# EAGLE schematic PC (EAGLE 9.6.2)
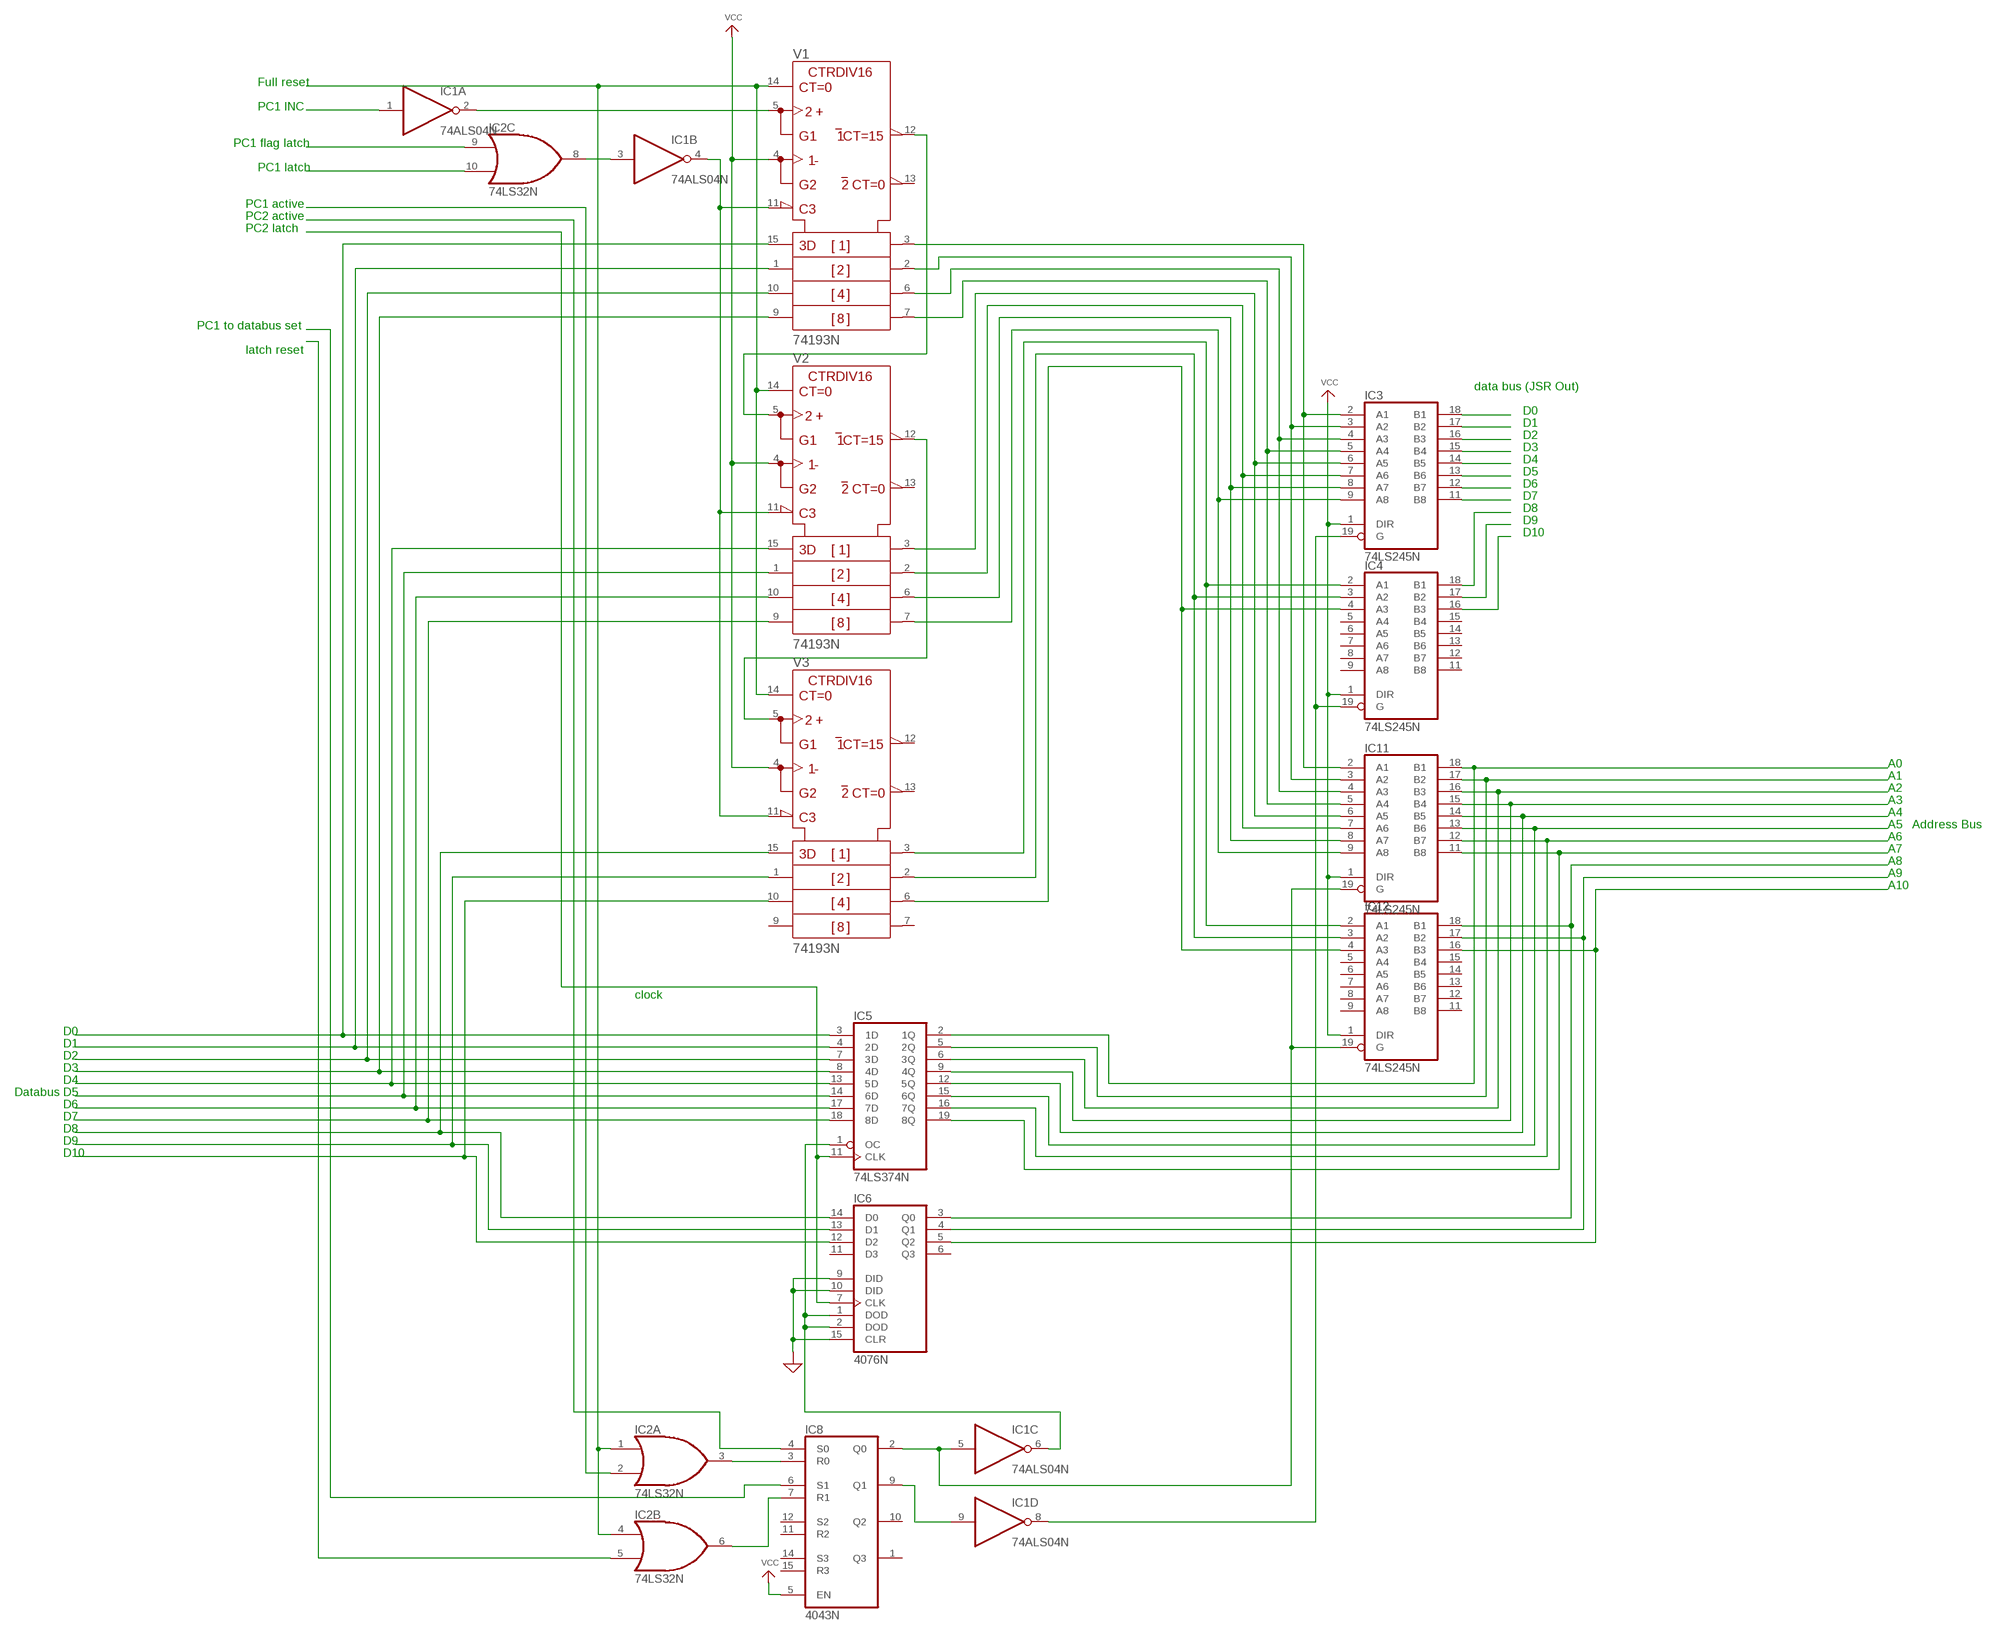
[diagram p0: schematic, sheet 1]

## Parts
IC1  74ALS04N  [DIL14]
IC2  74LS32N  [DIL14]
IC3  74LS245N  [DIL20]
IC4  74LS245N  [DIL20]
IC5  74LS374N  [DIL20]
IC6  4076N  [DIL16]
IC8  4043N  [DIL16]
IC11  74LS245N  [DIL20]
IC12  74LS245N  [DIL20]
V1  74193N  [DIL16]
V2  74193N  [DIL16]
V3  74193N  [DIL16]

## Nets
GND: IC6.9(DID) IC6.10(DID) IC6.15(CLR) ; supply symbol labelled SUP
N$1: V1.12(!CO) V2.5(UP)
N$2: IC8.6(S1)
N$3: V2.12(!CO) V3.5(UP)
N$4: IC1.2(A:O) V1.5(UP)
N$5: IC1.4(B:O) V1.11(!LOAD) V2.11(!LOAD) V3.11(!LOAD)
N$6: IC1.3(B:I) IC2.8(C:O)
N$7: IC2.9(C:I0)
N$8: IC2.10(C:I1)
N$9: IC2.3(A:O) IC8.3(R0)
N$10: IC5.11(CLK) IC6.7(CLK)
N$11: IC2.2(A:I1)
N$12: IC1.5(C:I) IC8.2(Q0) IC11.19(G) IC12.19(G)
N$13: IC6.3(Q0) IC12.18(B1)
N$14: IC8.4(S0)
N$15: IC5.3(1D) V1.15(A)
N$16: IC3.2(A1) IC11.2(A1) V1.3(QA)
N$17: IC5.7(3D) V1.10(C)
N$18: IC5.8(4D) V1.9(D)
N$19: IC5.13(5D) V2.15(A)
N$20: IC5.14(6D) V2.1(B)
N$21: IC5.17(7D) V2.10(C)
N$22: IC3.3(A2) IC11.3(A2) V1.2(QB)
N$23: IC6.14(D0) V3.15(A)
N$24: IC6.13(D1) V3.1(B)
N$25: IC6.12(D2) V3.10(C)
N$26: IC1.1(A:I)
N$27: IC5.4(2D) V1.1(B)
N$28: IC3.5(A4) IC11.5(A4) V1.7(QD)
N$29: IC3.6(A5) IC11.6(A5) V2.3(QA)
N$30: IC3.7(A6) IC11.7(A6) V2.2(QB)
N$31: IC5.18(8D) V2.9(D)
N$32: IC3.8(A7) IC11.8(A7) V2.6(QC)
N$34: IC4.2(A1) IC12.2(A1) V3.3(QA)
N$35: IC4.3(A2) IC12.3(A2) V3.2(QB)
N$36: IC4.4(A3) IC12.4(A3) V3.6(QC)
N$37: IC2.1(A:I0) IC2.4(B:I0) V1.14(CLR) V2.14(CLR) V3.14(CLR)
N$38: IC2.5(B:I1)
N$39: IC1.9(D:I) IC8.9(Q1)
N$40: IC2.6(B:O) IC8.7(R1)
N$41: IC1.8(D:O) IC3.19(G) IC4.19(G)
N$42: IC1.6(C:O) IC5.1(OC) IC6.1(DOD) IC6.2(DOD)
N$44: IC3.4(A3) IC11.4(A3) V1.6(QC)
N$47: IC5.2(1Q) IC11.18(B1)
N$50: IC3.18(B1)
N$51: IC3.17(B2)
N$52: IC3.16(B3)
N$53: IC3.15(B4)
N$54: IC3.14(B5)
N$55: IC3.13(B6)
N$56: IC3.12(B7)
N$57: IC3.11(B8)
N$58: IC4.18(B1)
N$59: IC4.17(B2)
N$60: IC4.16(B3)
N$62: IC5.5(2Q) IC11.17(B2)
N$63: IC5.6(3Q) IC11.16(B3)
N$64: IC5.9(4Q) IC11.15(B4)
N$65: IC5.12(5Q) IC11.14(B5)
N$68: IC5.15(6Q) IC11.13(B6)
N$69: IC5.16(7Q) IC11.12(B7)
N$70: IC5.19(8Q) IC11.11(B8)
N$71: IC3.9(A8) IC11.9(A8) V2.7(QD)
N$72: IC6.4(Q1) IC12.17(B2)
N$73: IC6.5(Q2) IC12.16(B3)
VCC: IC3.1(DIR) IC4.1(DIR) IC8.5(EN) IC11.1(DIR) IC12.1(DIR) V1.4(DOWN) V2.4(DOWN) V3.4(DOWN)
Unconnected: IC1.10(E:O) IC1.11(E:I) IC1.12(F:O) IC1.13(F:I) IC2.11(D:O) IC2.12(D:I0) IC2.13(D:I1) IC4.5(A4) IC4.6(A5) IC4.7(A6) IC4.8(A7) IC4.9(A8) IC4.11(B8) IC4.12(B7) IC4.13(B6) IC4.14(B5) IC4.15(B4) IC6.6(Q3) IC6.11(D3) IC8.1(Q3) IC8.10(Q2) IC8.11(R2) IC8.12(S2) IC8.14(S3) IC8.15(R3) IC12.5(A4) IC12.6(A5) IC12.7(A6) IC12.8(A7) IC12.9(A8) IC12.11(B8) IC12.12(B7) IC12.13(B6) IC12.14(B5) IC12.15(B4) V1.13(!BO) V2.13(!BO) V3.7(QD) V3.9(D) V3.12(!CO) V3.13(!BO)

## Notes on the sheet
- Full reset
- PC1 INC
- PC1 flag latch
- PC1 latch
- PC1 active
- PC2 active
- PC2 latch
- PC1 to databus set
- latch reset
- data bus (JSR Out)
- D0
- D1
- D2
- D3
- D4
- D5
- D6
- D7
- D8
- D9
- D10
- A0
- A1
- A2
- A3
- A4
- A5 | Address Bus
- A6
- A7
- A8
- A9
- A10
- clock
- D0
- D1
- D2
- D3
- D4
- Databus | D5
- D6
- D7
- D8
- D9
- D10

## Power pins joined to a net without a drawn wire
+UB: V1.16(+UB) V2.16(+UB) V3.16(+UB)
-UB: V1.8(-UB) V2.8(-UB) V3.8(-UB)
GND: IC1.7(P:GND) IC2.7(P:GND) IC3.10(GND) IC4.10(GND) IC5.10(GND) IC11.10(GND) IC12.10(GND)
VCC: IC1.14(P:VCC) IC2.14(P:VCC) IC3.20(VCC) IC4.20(VCC) IC5.20(VCC) IC11.20(VCC) IC12.20(VCC)
VDD: IC6.16(VDD) IC8.16(VDD)
VSS: IC6.8(VSS) IC8.8(VSS)

## Library data of the parts
IC1 = 74xx-us:74*04: Hex INVERTER
IC2 = 74xx-us:74*32: Quad 2-input OR gate
IC3 IC4 IC11 IC12 = 74xx-us:74*245: Octal BUS TRANSCEIVER, 3-state
IC5 = 74xx-us:74*374: Octal D type transparent LATCH, edge triggered
IC6 = 40xx:4076: Quad D-type REGISTER
IC8 = 40xx:4043: Quad 3-state NOR R/S LATCH
V1-V3 = 74ttl-din:74*193: Synchronus 4-bit up down COUNTER